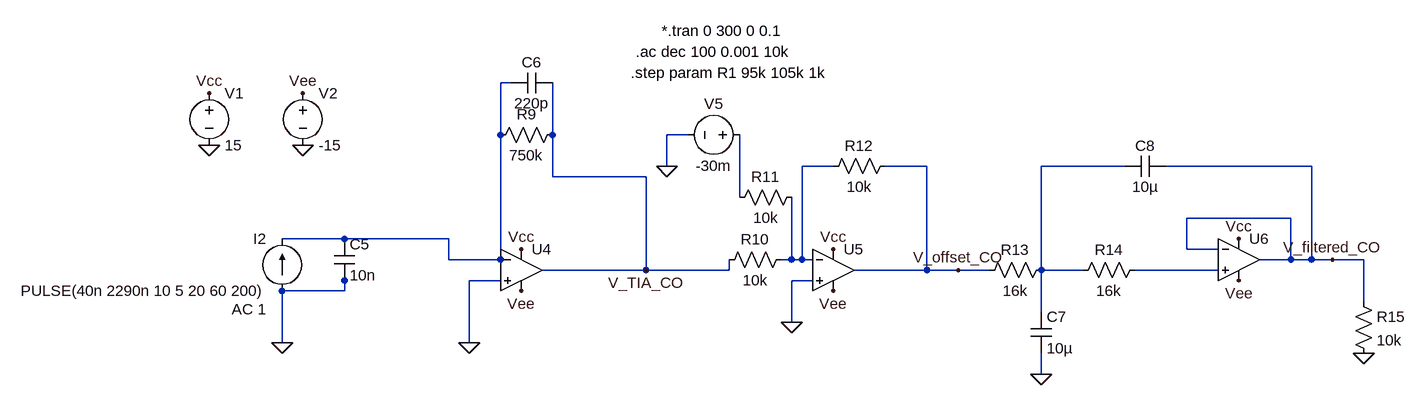
[diagram p0: schematic EE252-File1-COChannel.asc]
EE252-File1-COChannel.asc, the LTspice schematic file:
Version 4.1
SHEET 1 2164 1460
WIRE 528 912 512 912
WIRE 512 992 512 912
WIRE 592 992 592 912
WIRE 800 992 768 992
WIRE 768 1040 768 992
WIRE 1024 1040 976 1040
WIRE 1168 1040 1104 1040
WIRE 1472 1040 1344 1040
WIRE 1760 1040 1536 1040
WIRE 592 1056 592 992
WIRE 736 1056 592 1056
WIRE 880 1088 880 992
WIRE 1728 1120 1568 1120
WIRE 272 1152 176 1152
WIRE 432 1152 272 1152
WIRE 1568 1168 1568 1120
WIRE 1616 1168 1568 1168
WIRE 432 1184 432 1152
WIRE 512 1184 512 992
WIRE 512 1184 432 1184
WIRE 960 1184 960 1088
WIRE 960 1184 944 1184
WIRE 976 1184 976 1040
WIRE 976 1184 960 1184
WIRE 992 1184 976 1184
WIRE 1728 1184 1728 1120
WIRE 1728 1184 1680 1184
WIRE 1760 1184 1760 1040
WIRE 1760 1184 1728 1184
WIRE 1792 1184 1760 1184
WIRE 1840 1184 1792 1184
WIRE 736 1200 736 1056
WIRE 736 1200 576 1200
WIRE 864 1200 864 1184
WIRE 864 1200 736 1200
WIRE 1168 1200 1168 1040
WIRE 1168 1200 1056 1200
WIRE 1216 1200 1168 1200
WIRE 1264 1200 1216 1200
WIRE 1344 1200 1344 1040
WIRE 1408 1200 1344 1200
WIRE 1616 1200 1488 1200
WIRE 272 1216 272 1200
WIRE 512 1216 464 1216
WIRE 992 1216 960 1216
WIRE 272 1232 272 1216
WIRE 272 1232 176 1232
WIRE 1840 1248 1840 1184
WIRE 1344 1264 1344 1200
WIRE 960 1280 960 1216
WIRE 176 1312 176 1232
WIRE 464 1312 464 1216
WIRE 1344 1360 1344 1328
FLAG 736 1200 V_TIA_CO
FLAG 768 1040 0
FLAG 960 1280 0
FLAG 1344 1360 0
FLAG 1216 1200 V_offset_CO
FLAG 1840 1328 0
FLAG 464 1312 0
FLAG 176 1312 0
FLAG 1792 1184 V_filtered_CO
FLAG 64 1008 0
FLAG 64 928 Vcc
FLAG 544 1168 Vcc
FLAG 1024 1168 Vcc
FLAG 1648 1152 Vcc
FLAG 208 1008 0
FLAG 208 928 Vee
FLAG 544 1232 Vee
FLAG 1024 1232 Vee
FLAG 1648 1216 Vee
DATAFLAG 960 1232 ""
DATAFLAG 1344 1328 ""
DATAFLAG 1840 1328 ""
DATAFLAG 464 1280 ""
DATAFLAG 176 1280 ""
SYMBOL current 176 1232 R180
WINDOW 0 24 80 Left 2
WINDOW 3 24 0 Left 2
WINDOW 123 24 -28 Left 2
WINDOW 39 0 0 Left 0
SYMATTR InstName I2
SYMATTR Value PULSE(40n 2290n 10 5 20 60 200)
SYMATTR Value2 AC 1
SYMBOL cap 256 1152 R0
SYMATTR InstName C5
SYMATTR Value 10n
SYMBOL OpAmps\\UniversalOpAmp2 544 1200 R0
SYMATTR InstName U4
SYMATTR Value2 Avol=1Meg GBW=1Meg Slew=10Meg
SYMATTR SpiceLine Ilimit=25m Rail=2 Vos=0
SYMATTR SpiceLine2 En=0 Enk=0 In=0 Ink=0 Rin=1T
SYMBOL res 608 976 R90
WINDOW 0 0 56 VBottom 2
WINDOW 3 32 56 VTop 2
SYMATTR InstName R9
SYMATTR Value 750k
SYMBOL cap 592 896 R90
WINDOW 0 0 32 VBottom 2
WINDOW 3 32 32 VTop 2
SYMATTR InstName C6
SYMATTR Value 220p
SYMBOL OpAmps\\UniversalOpAmp2 1024 1200 R0
SYMATTR InstName U5
SYMATTR Value2 Avol=1Meg GBW=1Meg Slew=10Meg
SYMATTR SpiceLine Ilimit=25m Rail=2 Vos=0
SYMATTR SpiceLine2 En=0 Enk=0 In=0 Ink=0 Rin=1T
SYMBOL res 960 1168 R90
WINDOW 0 0 56 VBottom 2
WINDOW 3 32 56 VTop 2
SYMATTR InstName R10
SYMATTR Value 10k
SYMBOL res 976 1072 R90
WINDOW 0 0 56 VBottom 2
WINDOW 3 32 56 VTop 2
SYMATTR InstName R11
SYMATTR Value 10k
SYMBOL voltage 896 992 R90
WINDOW 0 -32 56 VBottom 2
WINDOW 3 32 56 VTop 2
WINDOW 123 0 0 Left 0
WINDOW 39 0 0 Left 0
SYMATTR InstName V5
SYMATTR Value -30m
SYMBOL res 1120 1024 R90
WINDOW 0 0 56 VBottom 2
WINDOW 3 32 56 VTop 2
SYMATTR InstName R12
SYMATTR Value 10k
SYMBOL res 1360 1184 R90
WINDOW 0 0 56 VBottom 2
WINDOW 3 32 56 VTop 2
SYMATTR InstName R13
SYMATTR Value 16k
SYMBOL cap 1328 1264 R0
SYMATTR InstName C7
SYMATTR Value 10µ
SYMBOL res 1504 1184 R90
WINDOW 0 0 56 VBottom 2
WINDOW 3 32 56 VTop 2
SYMATTR InstName R14
SYMATTR Value 16k
SYMBOL OpAmps\\UniversalOpAmp2 1648 1184 R0
SYMATTR InstName U6
SYMATTR Value2 Avol=1Meg GBW=1Meg Slew=10Meg
SYMATTR SpiceLine Ilimit=25m Rail=2 Vos=0
SYMATTR SpiceLine2 En=0 Enk=0 In=0 Ink=0 Rin=1T
SYMBOL cap 1536 1024 R90
WINDOW 0 0 32 VBottom 2
WINDOW 3 32 32 VTop 2
SYMATTR InstName C8
SYMATTR Value 10µ
SYMBOL res 1824 1232 R0
SYMATTR InstName R15
SYMATTR Value 10k
SYMBOL voltage 64 912 R0
WINDOW 123 0 0 Left 0
WINDOW 39 0 0 Left 0
SYMATTR InstName V1
SYMATTR Value 15
SYMBOL voltage 208 912 R0
WINDOW 123 0 0 Left 0
WINDOW 39 0 0 Left 0
SYMATTR InstName V2
SYMATTR Value -15
TEXT 720 864 Left 2 !.ac dec 100 0.001 10k
TEXT 760 832 Left 2 !*.tran 0 300 0 0.1
TEXT 712 896 Left 2 !.step param R1 95k 105k 1k

The netlist it stands for:
* EE252-File1-COChannel.asc
I2 0 N001 PULSE(40n 2290n 10 5 20 60 200) AC 1
C5 N001 0 10n
X§U4 0 N001 Vcc Vee V_TIA_CO level2 Avol=1Meg GBW=1Meg Slew=10Meg Ilimit=25m Rail=2 Vos=0 En=0 Enk=0 In=0 Ink=0 Rin=1T  ; pins In+ In- V+ V- OUT
R9 V_TIA_CO N001 750k
C6 V_TIA_CO N001 220p
X§U5 0 N002 Vcc Vee V_offset_CO level2 Avol=1Meg GBW=1Meg Slew=10Meg Ilimit=25m Rail=2 Vos=0 En=0 Enk=0 In=0 Ink=0 Rin=1T  ; pins In+ In- V+ V- OUT
R10 N002 V_TIA_CO 10k
R11 N002 N004 10k
V5 N004 0 -30m
R12 V_offset_CO N002 10k
R13 N003 V_offset_CO 16k
C7 N003 0 10µ
R14 N005 N003 16k
X§U6 N005 V_filtered_CO Vcc Vee V_filtered_CO level2 Avol=1Meg GBW=1Meg Slew=10Meg Ilimit=25m Rail=2 Vos=0 En=0 Enk=0 In=0 Ink=0 Rin=1T  ; pins In+ In- V+ V- OUT
C8 V_filtered_CO N003 10µ
R15 V_filtered_CO 0 10k
V1 Vcc 0 15
V2 Vee 0 -15
.ac dec 100 0.001 10k
*.tran 0 300 0 0.1
.step param R1 95k 105k 1k
.lib UniversalOpAmp2.lib
.backanno
.end